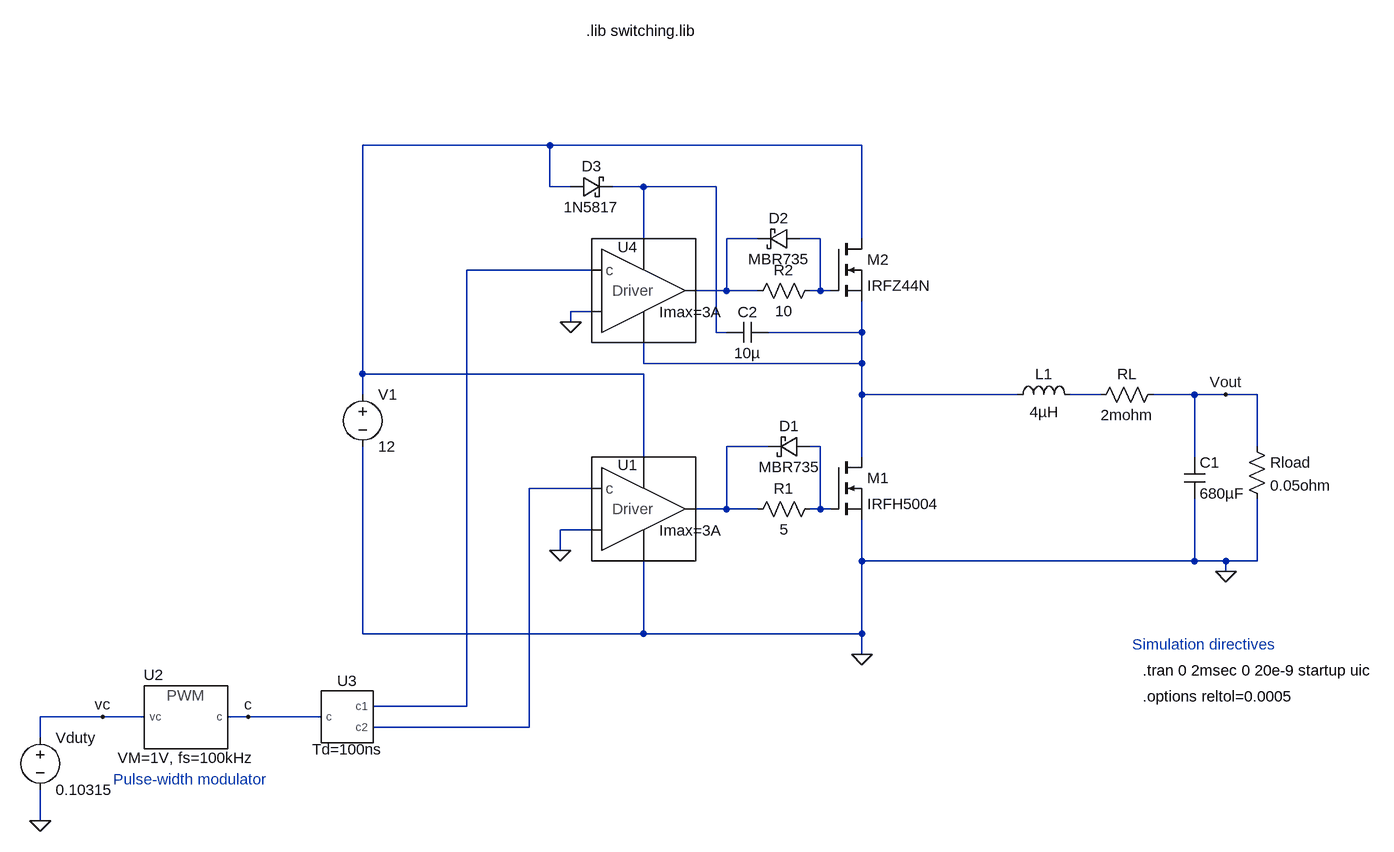
[diagram p0: schematic Buckdiode.asc]
Buckdiode.asc, the LTspice schematic file:
Version 4
SHEET 1 1636 680
WIRE 336 -640 48 -640
WIRE 816 -640 336 -640
WIRE 336 -576 336 -640
WIRE 368 -576 336 -576
WIRE 480 -576 432 -576
WIRE 592 -576 480 -576
WIRE 480 -496 480 -576
WIRE 656 -496 608 -496
WIRE 752 -496 720 -496
WIRE 816 -496 816 -640
WIRE 400 -448 208 -448
WIRE 608 -416 608 -496
WIRE 608 -416 560 -416
WIRE 656 -416 608 -416
WIRE 752 -416 752 -496
WIRE 752 -416 736 -416
WIRE 768 -416 752 -416
WIRE 400 -384 368 -384
WIRE 368 -368 368 -384
WIRE 592 -352 592 -576
WIRE 608 -352 592 -352
WIRE 816 -352 816 -400
WIRE 816 -352 672 -352
WIRE 480 -304 480 -336
WIRE 816 -304 816 -352
WIRE 816 -304 480 -304
WIRE 48 -288 48 -640
WIRE 480 -288 48 -288
WIRE 48 -256 48 -288
WIRE 816 -256 816 -304
WIRE 1056 -256 816 -256
WIRE 1184 -256 1136 -256
WIRE 1328 -256 1264 -256
WIRE 1376 -256 1328 -256
WIRE 1424 -256 1376 -256
WIRE 672 -176 608 -176
WIRE 752 -176 736 -176
WIRE 1424 -176 1424 -256
WIRE 480 -160 480 -288
WIRE 816 -160 816 -256
WIRE 1328 -160 1328 -256
WIRE 400 -112 304 -112
WIRE 608 -80 608 -176
WIRE 608 -80 560 -80
WIRE 656 -80 608 -80
WIRE 752 -80 752 -176
WIRE 752 -80 736 -80
WIRE 768 -80 752 -80
WIRE 400 -48 352 -48
WIRE 352 -16 352 -48
WIRE 816 0 816 -64
WIRE 1328 0 1328 -96
WIRE 1328 0 816 0
WIRE 1376 0 1328 0
WIRE 1424 0 1424 -96
WIRE 1424 0 1376 0
WIRE 1376 16 1376 0
WIRE 48 112 48 -176
WIRE 480 112 480 0
WIRE 480 112 48 112
WIRE 816 112 816 0
WIRE 816 112 480 112
WIRE 816 144 816 112
WIRE 208 224 208 -448
WIRE 208 224 64 224
WIRE -352 240 -448 240
WIRE -288 240 -352 240
WIRE -128 240 -160 240
WIRE -16 240 -128 240
WIRE 304 256 304 -112
WIRE 304 256 64 256
WIRE -448 272 -448 240
WIRE -448 400 -448 352
FLAG -448 400 0
FLAG 1376 16 0
FLAG 1376 -256 Vout
FLAG -128 240 c
FLAG -352 240 vc
FLAG 352 -16 0
FLAG 368 -368 0
FLAG 816 144 0
SYMBOL voltage -448 256 R0
WINDOW 123 0 0 Left 0
WINDOW 39 0 0 Left 0
SYMATTR InstName Vduty
SYMATTR Value 0.10315
SYMBOL cap 1312 -160 R0
SYMATTR InstName C1
SYMATTR Value 680µF
SYMBOL res 1408 -192 R0
SYMATTR InstName Rload
SYMATTR Value 0.05ohm
SYMBOL ind 1040 -240 R270
WINDOW 0 32 56 VTop 2
WINDOW 3 5 56 VBottom 2
SYMATTR InstName L1
SYMATTR Value 4µH
SYMBOL res 1280 -272 R90
WINDOW 0 0 56 VBottom 2
WINDOW 3 32 56 VTop 2
SYMATTR InstName RL
SYMATTR Value 2mohm
SYMBOL PWM -224 240 R0
SYMATTR InstName U2
SYMATTR SpiceLine2 Dmin=0, Dmax=0.9, Voffset=0
SYMBOL dead_time 16 240 R0
SYMATTR InstName U3
SYMBOL res 752 -96 R90
WINDOW 0 0 56 VBottom 2
WINDOW 3 32 56 VTop 2
SYMATTR InstName R1
SYMATTR Value 5
SYMBOL res 752 -432 R90
WINDOW 0 0 56 VBottom 2
WINDOW 3 32 56 VTop 2
SYMATTR InstName R2
SYMATTR Value 10
SYMBOL nmos 768 -160 R0
SYMATTR InstName M1
SYMATTR Value IRFH5004
SYMBOL Driver 464 -80 R0
SYMATTR InstName U1
SYMBOL schottky 736 -192 R90
WINDOW 0 0 32 VBottom 2
WINDOW 3 32 32 VTop 2
SYMATTR InstName D1
SYMATTR Value MBR735
SYMATTR Description Diode
SYMATTR Type diode
SYMBOL schottky 720 -512 R90
WINDOW 0 0 32 VBottom 2
WINDOW 3 32 32 VTop 2
SYMATTR InstName D2
SYMATTR Value MBR735
SYMATTR Description Diode
SYMATTR Type diode
SYMBOL Driver 464 -416 R0
SYMATTR InstName U4
SYMBOL voltage 48 -272 R0
WINDOW 123 0 0 Left 0
WINDOW 39 0 0 Left 0
SYMATTR InstName V1
SYMATTR Value 12
SYMBOL nmos 768 -496 R0
SYMATTR InstName M2
SYMATTR Value IRFZ44N
SYMBOL schottky 368 -560 R270
WINDOW 0 32 32 VTop 2
WINDOW 3 0 32 VBottom 2
SYMATTR InstName D3
SYMATTR Value 1N5817
SYMATTR Description Diode
SYMATTR Type diode
SYMBOL cap 672 -368 R90
WINDOW 0 0 32 VBottom 2
WINDOW 3 32 32 VTop 2
SYMATTR InstName C2
SYMATTR Value 10µ
TEXT 1248 168 Left 2 !.tran 0 2msec 0 20e-9 startup uic
TEXT -336 336 Left 2 ;Pulse-width modulator
TEXT 1232 128 Left 2 ;Simulation directives
TEXT 392 -816 Left 2 !.lib switching.lib
TEXT 1248 208 Left 2 !.options reltol=0.0005

The netlist it stands for:
* Buckdiode.asc
Vduty vc 0 0.10315
C1 Vout 0 680µF
Rload Vout 0 0.05ohm
L1 N006 N007 4µH
RL Vout N007 2mohm
XU2 vc c PWM VM=1V, fs=100kHz Dmin=0, Dmax=0.9, Voffset=0  ; pins vc c
XU3 c N005 N010 dead_time Td=100ns  ; pins c c1 c2
R1 N009 N008 5
R2 N004 N003 10
M1 N006 N009 0 0 IRFH5004
XU1 N010 N001 0 0 N008 driver Imax=3A Tdelay=30ns, IQ=1mA, Vuvl=9V  ; pins c Vdd Vss Vssin out
D1 N009 N008 MBR735
D2 N004 N003 MBR735
XU4 N005 N002 N006 0 N003 driver Imax=3A Tdelay=30ns, IQ=1mA, Vuvl=9V  ; pins c Vdd Vss Vssin out
V1 N001 0 12
M2 N001 N004 N006 N006 IRFZ44N
D3 N001 N002 1N5817
C2 N006 N002 10µ
.model D D
.lib standard.dio
.model NMOS NMOS
.model PMOS PMOS
.lib standard.mos
.tran 0 2msec 0 20e-9 startup uic
* Pulse-width modulator
* Simulation directives
.lib switching.lib
.options reltol=0.0005
.backanno
.end